# EAGLE design WS2812BShield (EAGLE 7.4.0)
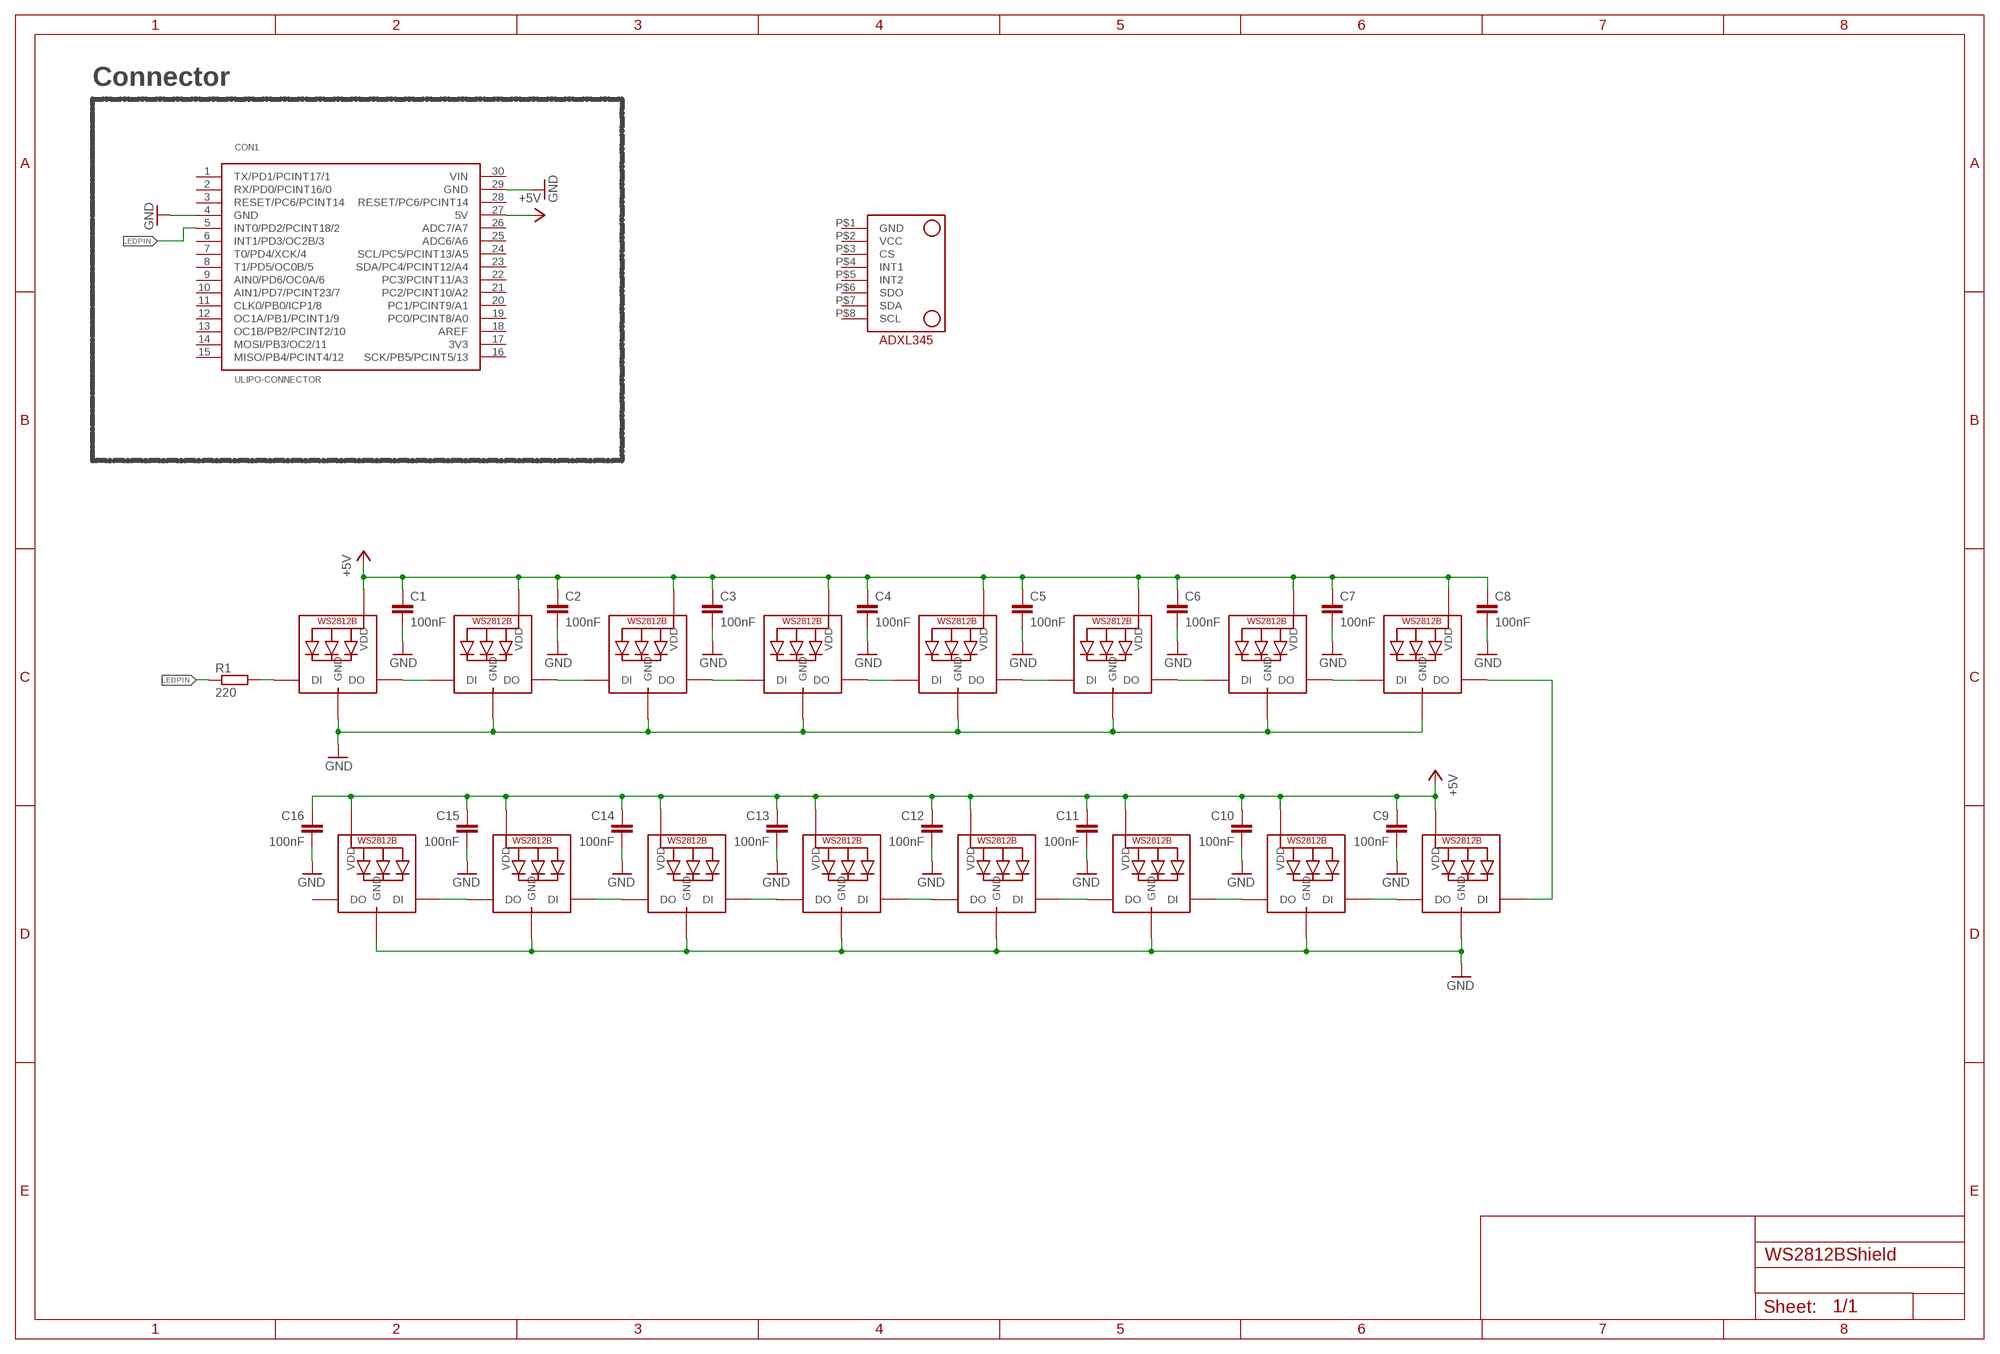
[diagram p0: schematic, sheet 1]

## Parts
C1  100nF  C-EUC0603K  [C0603K]
C2  100nF  C-EUC0603K  [C0603K]
C3  100nF  C-EUC0603K  [C0603K]
C4  100nF  C-EUC0603K  [C0603K]
C5  100nF  C-EUC0603K  [C0603K]
C6  100nF  C-EUC0603K  [C0603K]
C7  100nF  C-EUC0603K  [C0603K]
C8  100nF  C-EUC0603K  [C0603K]
C9  100nF  C-EUC0603K  [C0603K]
C10  100nF  C-EUC0603K  [C0603K]
C11  100nF  C-EUC0603K  [C0603K]
C12  100nF  C-EUC0603K  [C0603K]
C13  100nF  C-EUC0603K  [C0603K]
C14  100nF  C-EUC0603K  [C0603K]
C15  100nF  C-EUC0603K  [C0603K]
C16  100nF  C-EUC0603K  [C0603K]
CON1  ULIPO-CONNECTOR  [ULIPO-CONNECTOR]
LED1  WS2812B5050  [WS2812B]
LED2  WS2812B5050  [WS2812B]
LED3  WS2812B5050  [WS2812B]
LED4  WS2812B5050  [WS2812B]
LED5  WS2812B5050  [WS2812B]
LED6  WS2812B5050  [WS2812B]
LED7  WS2812B5050  [WS2812B]
LED8  WS2812B5050  [WS2812B]
LED9  WS2812B5050  [WS2812B]
LED10  WS2812B5050  [WS2812B]
LED11  WS2812B5050  [WS2812B]
LED12  WS2812B5050  [WS2812B]
LED13  WS2812B5050  [WS2812B]
LED14  WS2812B5050  [WS2812B]
LED15  WS2812B5050  [WS2812B]
LED16  WS2812B5050  [WS2812B]
R1  220  R-EU_R0603  [R0603]
U$1  ADXL345  [ADXL345]

## Nets
+5V: C1.1 C2.1 C3.1 C4.1 C5.1 C6.1 C7.1 C8.1 C9.1 C10.1 C11.1 C12.1 C13.1 C14.1 C15.1 C16.1 CON1.27(5V) LED1.1-VDD(VDD) LED2.1-VDD(VDD) LED3.1-VDD(VDD) LED4.1-VDD(VDD) LED5.1-VDD(VDD) LED6.1-VDD(VDD) LED7.1-VDD(VDD) LED8.1-VDD(VDD) LED9.1-VDD(VDD) LED10.1-VDD(VDD) LED11.1-VDD(VDD) LED12.1-VDD(VDD) LED13.1-VDD(VDD) LED14.1-VDD(VDD) LED15.1-VDD(VDD) LED16.1-VDD(VDD)
GND: C1.2 C2.2 C3.2 C4.2 C5.2 C6.2 C7.2 C8.2 C9.2 C10.2 C11.2 C12.2 C13.2 C14.2 C15.2 C16.2 CON1.4(GND) CON1.29(GND) LED1.3-GND(GND) LED2.3-GND(GND) LED3.3-GND(GND) LED4.3-GND(GND) LED5.3-GND(GND) LED6.3-GND(GND) LED7.3-GND(GND) LED8.3-GND(GND) LED9.3-GND(GND) LED10.3-GND(GND) LED11.3-GND(GND) LED12.3-GND(GND) LED13.3-GND(GND) LED14.3-GND(GND) LED15.3-GND(GND) LED16.3-GND(GND)
LEDPIN: CON1.5(INT0/PD2/PCINT18/2) R1.1
N$1: LED1.4-DIN(DI) R1.2
N$2: LED1.2-DOUT(DO) LED2.4-DIN(DI)
N$3: LED2.2-DOUT(DO) LED3.4-DIN(DI)
N$4: LED3.2-DOUT(DO) LED4.4-DIN(DI)
N$5: LED4.2-DOUT(DO) LED5.4-DIN(DI)
N$6: LED5.2-DOUT(DO) LED6.4-DIN(DI)
N$7: LED6.2-DOUT(DO) LED7.4-DIN(DI)
N$8: LED7.2-DOUT(DO) LED8.4-DIN(DI)
N$9: LED9.2-DOUT(DO) LED10.4-DIN(DI)
N$10: LED10.2-DOUT(DO) LED11.4-DIN(DI)
N$11: LED11.2-DOUT(DO) LED12.4-DIN(DI)
N$12: LED12.2-DOUT(DO) LED13.4-DIN(DI)
N$13: LED13.2-DOUT(DO) LED14.4-DIN(DI)
N$14: LED14.2-DOUT(DO) LED15.4-DIN(DI)
N$15: LED15.2-DOUT(DO) LED16.4-DIN(DI)
N$16: LED8.2-DOUT(DO) LED9.4-DIN(DI)
Unconnected: CON1.1(TX/PD1/PCINT17/1) CON1.2(RX/PD0/PCINT16/0) CON1.3(RESET/PC6/PCINT14) CON1.6(INT1/PD3/OC2B/3) CON1.7(T0/PD4/XCK/4) CON1.8(T1/PD5/OC0B/5) CON1.9(AIN0/PD6/OC0A/6) CON1.10(AIN1/PD7/PCINT23/7) CON1.11(CLK0/PB0/ICP1/8) CON1.12(OC1A/PB1/PCINT1/9) CON1.13(OC1B/PB2/PCINT2/10) CON1.14(MOSI/PB3/OC2/11) CON1.15(MISO/PB4/PCINT4/12) CON1.16(SCK/PB5/PCINT5/13) CON1.17(3V3) CON1.18(AREF) CON1.19(PC0/PCINT8/A0) CON1.20(PC1/PCINT9/A1) CON1.21(PC2/PCINT10/A2) CON1.22(PC3/PCINT11/A3) CON1.23(SDA/PC4/PCINT12/A4) CON1.24(SCL/PC5/PCINT13/A5) CON1.25(ADC6/A6) CON1.26(ADC7/A7) CON1.28(RESET/PC6/PCINT14) CON1.30(VIN) LED16.2-DOUT(DO) U$1.P$1(GND) U$1.P$2(VCC) U$1.P$3(CS) U$1.P$4(INT1) U$1.P$5(INT2) U$1.P$6(SDO) U$1.P$7(SDA) U$1.P$8(SCL)

## Notes on the sheet
- Connector

## Library data of the parts
C1-C16 = rcl:C-EU: CAPACITOR, European symbol
CON1 = TM-misc:ULIPO-CONNECTOR: Connector for the uLipo Dev Board
LED1-LED16 = adafruit:WS2812B
R1 = rcl:R-EU_: RESISTOR, European symbol
U$1 = davidbeermann:ADXL345: ADXL345 Digital 3-Axis Accelerometer The sensor module ADXL345 is a 3-axis accelerometer with low power consumption. This module was purchased at Eckstein Komponente <http://eckstein-shop.de/GY-291-ADXL345-Digital-3-Axis-Gravity-Acceleration-Beschleunigung-Sensor_1>.

## Module C1
Ports: 

### Library data of the parts

## Board
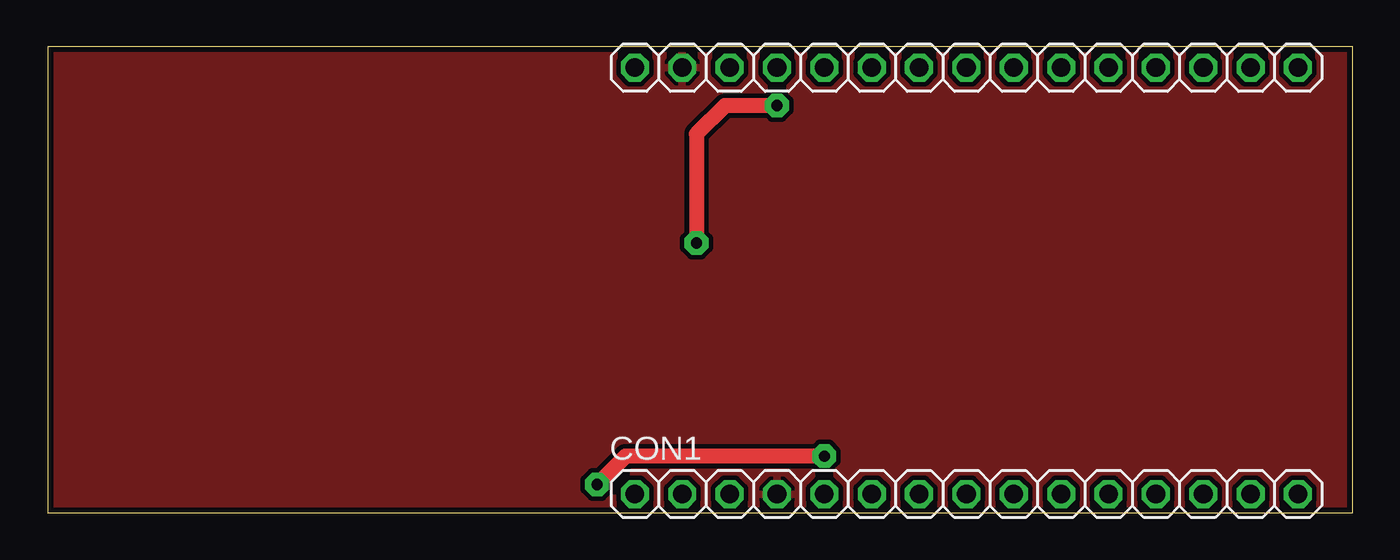
[diagram p1: board, top side]
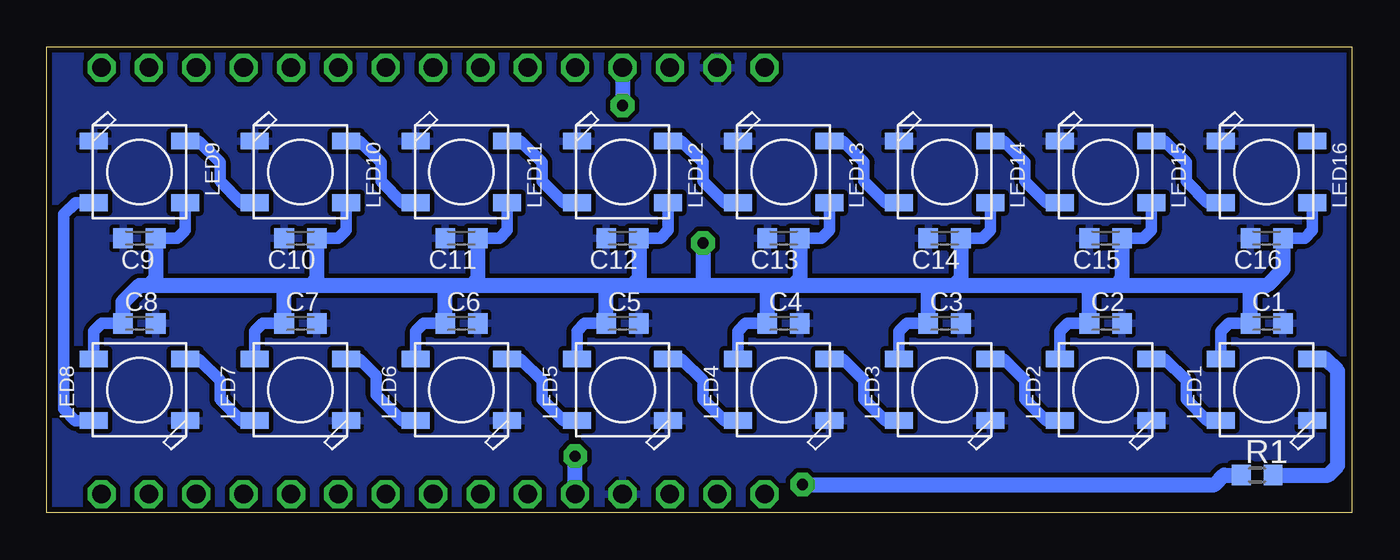
[diagram p2: board, bottom side, seen from below]

Size 70 x 25 mm. Coordinates in mm from the lower left corner, seen from the top.
Outline: 0,0 70,0 70,25 0,25 0,0
Copper layers (1*16): Top 0.035mm / dielectric 1.5mm / Bottom 0.035mm
Design rules "PCB-POOL Standard_editM": minimum track width 0.15mm, minimum drill 0.3mm, track to track 0.15mm, track to pad 0.15mm, pad to pad 0.15mm, via to via 0.15mm, smd to smd 0.15mm, copper to edge 0.3mm, drill to drill 0.2mm, minimum pad ring 0.2mm, minimum via ring 0.15mm, stop-mask expansion 0.075mm, vias tented up to drill 0mil, thermal gap 0.2mm

### Footprints (pad centres in the part's own frame; a part is rotated, then mirrored left to right if it is on the bottom)
C0603K = smd 1.05 x 1.08: 1 -0.875,0; 2 0.875,0
ULIPO-CONNECTOR = drill 1 pad 1.5 octagon: 1 -17.78,-11.43; 2 -15.24,-11.43; 3 -12.7,-11.43; 4 -10.16,-11.43; 5 -7.62,-11.43; 6 -5.08,-11.43; 7 -2.54,-11.43; 8 0,-11.43; 9 2.54,-11.43; 10 5.08,-11.43; 11 7.62,-11.43; 12 10.16,-11.43; 13 12.7,-11.43; 14 15.24,-11.43; 15 17.78,-11.43; 16 17.78,11.43; 17 15.24,11.43; 18 12.7,11.43; 19 10.16,11.43; 20 7.62,11.43; 21 5.08,11.43; 22 2.54,11.43; 23 0,11.43; 24 -2.54,11.43; 25 -5.08,11.43; 26 -7.62,11.43; 27 -10.16,11.43; 28 -12.7,11.43; 29 -15.24,11.43; 30 -17.78,11.43
WS2812B = smd 1.5 x 0.9: 1-VDD 2.45,-1.65; 2-DOUT 2.45,1.65; 3-GND -2.45,1.65; 4-DIN -2.45,-1.65
R0603 = smd 1 x 1.1: 1 -0.85,0; 2 0.85,0
ADXL345 = drill 0.8 pad 1.93: P$1 0,0; P$2 0,-2.54; P$3 0,-5.08; P$4 0,-7.62; P$5 0,-10.16; P$6 0,-12.7; P$7 0,-15.24; P$8 0,-17.78 | hole 3.2: 11.62,-1.28; 11.62,-16.27

### Placement (x,y rotation side)
C1  4.57,10.16 0 bottom
C2  13.21,10.16 0 bottom
C3  21.84,10.16 0 bottom
C4  30.48,10.16 0 bottom
C5  39.12,10.16 0 bottom
C6  47.75,10.16 0 bottom
C7  56.39,10.16 0 bottom
C8  65.02,10.16 0 bottom
C9  65.02,14.73 180 bottom
C10  56.39,14.73 180 bottom
C11  47.75,14.73 180 bottom
C12  39.12,14.73 180 bottom
C13  30.48,14.73 180 bottom
C14  21.84,14.73 180 bottom
C15  13.21,14.73 180 bottom
C16  4.57,14.73 180 bottom
CON1  49.28,12.45 0 top
LED1  4.57,6.6 180 bottom
LED2  13.21,6.6 180 bottom
LED3  21.84,6.6 180 bottom
LED4  30.48,6.6 180 bottom
LED5  39.12,6.6 180 bottom
LED6  47.75,6.6 180 bottom
LED7  56.39,6.6 180 bottom
LED8  65.02,6.6 180 bottom
LED9  65.02,18.29 0 bottom
LED10  56.39,18.29 0 bottom
LED11  47.75,18.29 0 bottom
LED12  39.12,18.29 0 bottom
LED13  30.48,18.29 0 bottom
LED14  21.84,18.29 0 bottom
LED15  13.21,18.29 0 bottom
LED16  4.57,18.29 0 bottom
R1  5.08,2.03 0 bottom
U$1  -14.73,-21.34 0 top  (outside the outline)

### Tracks (layer width: path | path; a pad name or v marks a point on that pad's centre or on a via)
+5V  (via drill 0.6 pad 1.27)
  Top 0.813: v39.12,21.84 36.32,21.84 34.8,20.32 v34.8,14.48
  Bottom 0.61: C4.1 32.51,10.16 32.93,9.74 LED4.1-VDD | C5.1 41.15,10.16 41.57,9.74 LED5.1-VDD | C6.1 49.78,10.16 50.2,9.74 LED6.1-VDD | C7.1 58.42,10.16 58.84,9.74 LED7.1-VDD | C8.1 67.06,10.16 67.47,9.74 LED8.1-VDD | C1.1 6.6,10.16 7.02,9.74 LED1.1-VDD | C2.1 15.24,10.16 15.66,9.74 LED2.1-VDD | C3.1 23.88,10.16 24.29,9.74 LED3.1-VDD | C16.1 2.54,14.73 2.12,15.15 LED16.1-VDD | C15.1 11.18,14.73 10.76,15.15 LED15.1-VDD | C14.1 19.81,14.73 19.39,15.15 LED14.1-VDD | C13.1 28.45,14.73 28.03,15.15 LED13.1-VDD | C12.1 37.08,14.73 36.67,15.15 LED12.1-VDD | C11.1 45.72,14.73 45.3,15.15 LED11.1-VDD | C10.1 54.36,14.73 53.94,15.15 LED10.1-VDD | C9.1 62.99,14.73 62.57,15.15 LED9.1-VDD | 5.45,12.05 5.59,12.19 | 14.08,11.82 13.72,12.19 | 22.72,11.82 22.35,12.19 | 31.36,11.82 30.99,12.19 | 39.99,11.82 39.62,12.19 | 48.63,11.82 48.26,12.19 | 57.26,11.82 56.9,12.19
  Bottom 0.813: C16.1 3.7,13.07 4.57,12.19 5.59,12.19 12.7,12.19 | 12.7,12.19 13.72,12.19 21.34,12.19 | 21.34,12.19 22.35,12.19 29.97,12.19 | 29.97,12.19 30.99,12.19 34.8,12.19 | 34.8,12.19 38.61,12.19 | 38.61,12.19 39.62,12.19 47.24,12.19 | 47.24,12.19 48.26,12.19 55.88,12.19 | 55.88,12.19 56.9,12.19 64.52,12.19 | 64.52,12.19 65.02,12.19 65.9,11.32 C8.1 | C1.1 5.45,12.05 | C2.1 14.08,11.82 | C3.1 22.72,11.82 | C14.1 20.97,12.56 21.34,12.19 | C4.1 31.36,11.82 | C13.1 29.61,12.56 29.97,12.19 | C5.1 39.99,11.82 | C12.1 38.24,12.56 38.61,12.19 | C6.1 48.63,11.82 | C11.1 46.88,12.56 47.24,12.19 | C7.1 57.26,11.82 | C10.1 55.51,12.56 55.88,12.19 | C9.1 64.15,12.56 64.52,12.19 | CON1.27 v39.12,21.84 | v34.8,14.48 34.8,12.19 | C15.1 12.33,12.56 12.7,12.19
GND
  pour Bottom (isolate 0.254): 0,0 70.1,0 70.1,25.15 0,25.15
  pour Top (isolate 0.254): 0,0 70.1,0 70.1,25.15 0,25.15
LEDPIN  (via drill 0.6 pad 1.27)
  Top 0.813: v41.66,3.05 30.99,3.05 v29.46,1.52
  Bottom 0.813: CON1.5 v41.66,3.05 | v29.46,1.52 7.37,1.52 6.86,2.03 R1.1
N$1
  Bottom 0.813: R1.2 1.27,2.03 0.76,2.54 0.76,7.62 1.4,8.25 LED1.4-DIN
N$2
  Bottom 0.61: LED1.2-DOUT 7.75,4.95 8.89,6.1 8.89,7.11 10.03,8.25 LED2.4-DIN
N$3
  Bottom 0.61: LED2.2-DOUT 16.38,4.95 17.53,6.1 17.53,7.11 18.67,8.25 LED3.4-DIN
N$4
  Bottom 0.61: LED3.2-DOUT 25.02,4.95 26.16,6.1 26.16,7.11 27.3,8.25 LED4.4-DIN
N$5
  Bottom 0.61: LED4.2-DOUT 33.66,4.95 34.8,6.1 34.8,7.11 35.94,8.25 LED5.4-DIN
N$6
  Bottom 0.61: LED5.2-DOUT 42.29,4.95 43.43,6.1 43.43,7.11 44.58,8.25 LED6.4-DIN
N$7
  Bottom 0.61: LED6.2-DOUT 50.93,4.95 52.32,6.35 52.32,7.37 53.21,8.25 LED7.4-DIN
N$8
  Bottom 0.61: LED7.2-DOUT 59.56,4.95 60.71,6.1 60.71,7.11 61.85,8.25 LED8.4-DIN
N$9
  Bottom 0.61: LED9.2-DOUT 61.85,19.94 60.71,18.8 60.71,17.78 59.56,16.64 LED10.4-DIN
N$10
  Bottom 0.61: LED10.2-DOUT 53.21,19.94 52.07,18.8 52.07,17.78 50.93,16.64 LED11.4-DIN
N$11
  Bottom 0.61: LED12.4-DIN 42.29,16.64 43.43,17.78 43.43,18.8 44.58,19.94 LED11.2-DOUT
N$12
  Bottom 0.61: LED13.4-DIN 33.66,16.64 34.8,17.78 34.8,18.8 35.94,19.94 LED12.2-DOUT
N$13
  Bottom 0.61: LED14.4-DIN 25.02,16.64 26.16,17.78 26.16,18.8 27.3,19.94 LED13.2-DOUT
N$14
  Bottom 0.61: LED15.4-DIN 16.38,16.64 17.53,17.78 17.53,18.8 18.67,19.94 LED14.2-DOUT
N$15
  Bottom 0.61: LED16.4-DIN 7.75,16.64 8.89,17.78 8.89,18.8 10.03,19.94 LED15.2-DOUT
N$16
  Bottom 0.61: LED8.2-DOUT 68.45,4.95 69.09,5.59 69.09,16 68.45,16.64 LED9.4-DIN